# Altium project RC522_RFID.PrjPcb
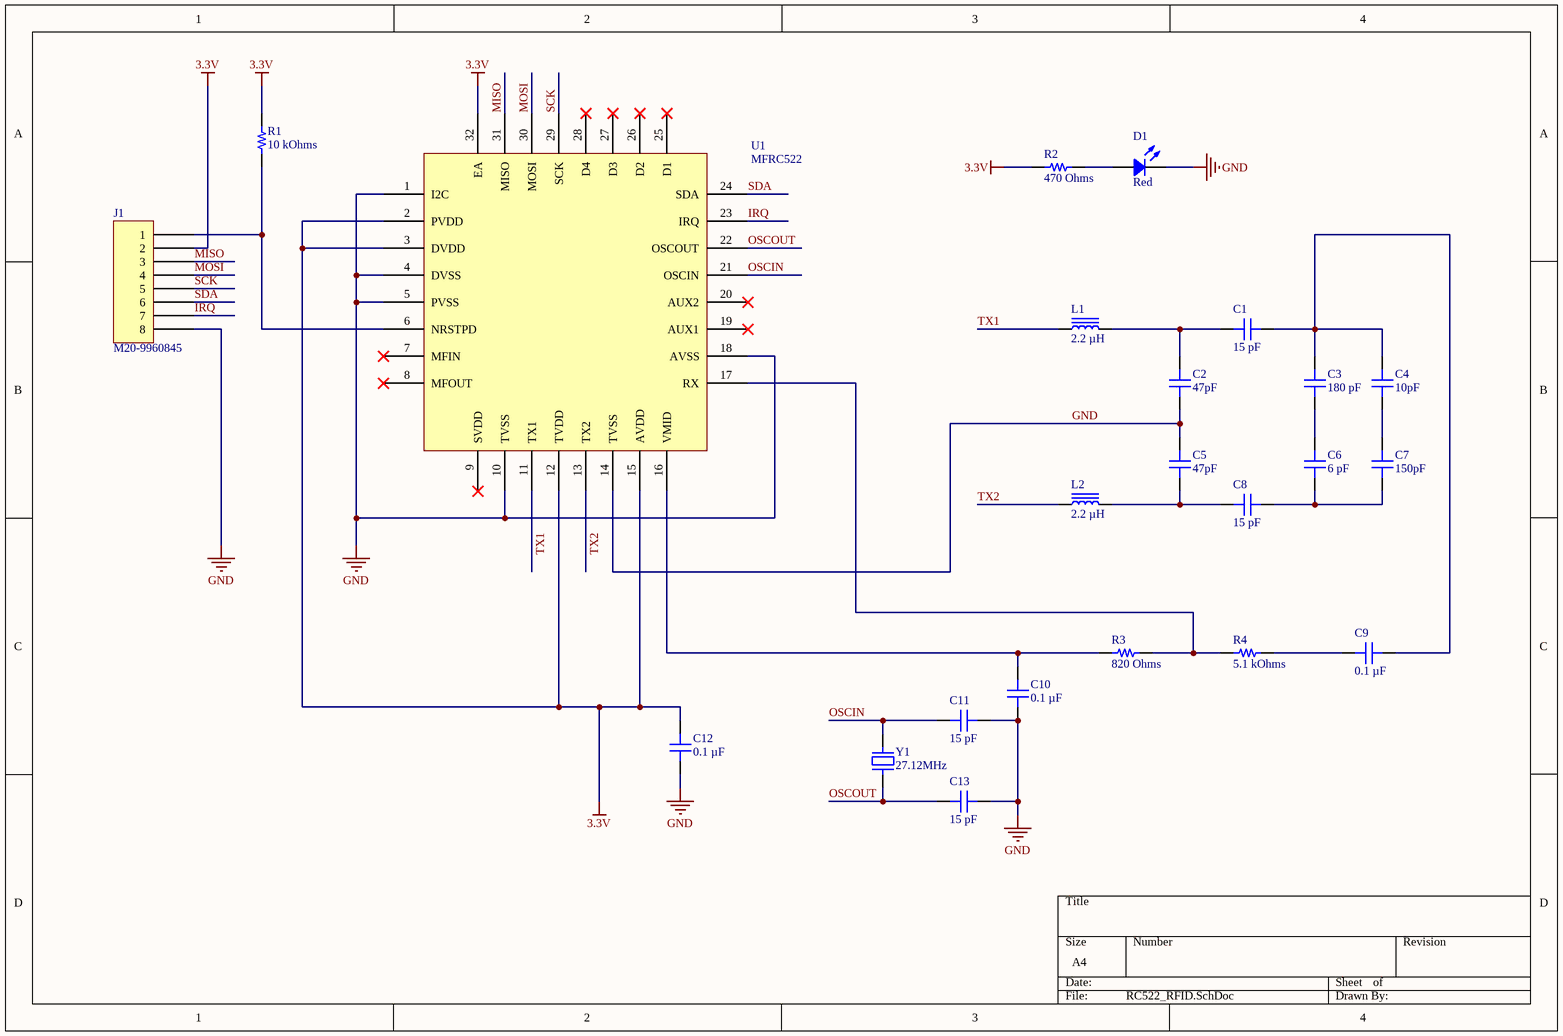
[diagram p0: RC522_RFID.SchDoc]
1 sheet, 23 parts. Net scope: global (net labels, ports and power ports of the same name join across sheets).
Board file: RC522_RFID.PcbDoc

## Sheet RC522_RFID.SchDoc
size A4; SheetNumber: 1; SheetTotal: 1

### Parts
C1  15 pF  [CAP 0805_2012]
C2  47pF  [CAP 0805_2012]
C3  180 pF  [CAP 0805_2012]
C4  10pF  [CAP 0805_2012]
C5  47pF  [CAP 0805_2012]
C6  6 pF  [CAP 0805_2012]
C7  150pF  [CAP 0805_2012]
C8  15 pF  [CAP 0805_2012]
C9  0.1 µF  [CAP 0805_2012]
C10  0.1 µF  [CAP 0805_2012]
C11  15 pF  [CAP 0805_2012]
C12  0.1 µF  [CAP 0805_2012]
C13  15 pF  [CAP 0805_2012]
D1  Red  [LED 0805_2012 RED]
J1  M20-9960845  [HARWIN M20-9960845]
L1  2.2 µH  [IND 0806_2016]
L2  2.2 µH  [IND 0806_2016]
R1  10 kOhms  [RES 0805_2012]
R2  470 Ohms  [YAGEO RES RK73 RS73 SG73 0805_2012]
R3  820 Ohms  [YAGEO RES 0805_2012]
R4  5.1 kOhms  [YAGEO RES RK73 RS73 SG73 0805_2012]
U1  MFRC522  [MFRC522]
Y1  27.12MHz  [TXC 9C]

### Nets
3.3V: C12.2 J1.2 R1.1 R2.1 U1.2(PVDD) U1.3(DVDD) U1.12(TVDD) U1.15(AVDD) U1.32(EA)
GND: C2.1 C5.2 C10.1 C11.1 C12.1 C13.2 D1.2 J1.8 U1.1(I2C) U1.4(DVSS) U1.5(PVSS) U1.10(TVSS) U1.14(TVSS) U1.18(AVSS)
IRQ: J1.7 U1.23(IRQ)
MISO: J1.3 U1.31(MISO)
MOSI: J1.4 U1.30(MOSI)
OSCIN: C11.2 U1.21(OSCIN) Y1.2
OSCOUT: C13.1 U1.22(OSCOUT) Y1.1
SCK: J1.5 U1.29(SCK)
SDA: J1.6 U1.24(SDA)
TX1: L1.1 U1.11(TX1)
TX2: L2.1 U1.13(TX2)
NetC1_1: C1.1 C2.2 L1.2
NetC1_2: C1.2 C3.2 C4.2 C9.2
NetC3_1: C3.1 C6.2
NetC4_1: C4.1 C7.2
NetC5_1: C5.1 C8.1 L2.2
NetC6_1: C6.1 C7.1 C8.2
NetC9_1: C9.1 R4.2
NetC10_2: C10.2 R3.1 U1.16(VMID)
NetD1_1: D1.1 R2.2
NetJ1_1: J1.1 R1.2 U1.6(NRSTPD)
NetR3_2: R3.2 R4.1 U1.17(RX)

Not connected (* = marked no-connect by the designer): U1 7(MFIN)* 8(MFOUT)* 9(SVDD)* 19(AUX1)* 20(AUX2)* 25(D1)* 26(D2)* 27(D3)* 28(D4)*

### Library data of the parts
C1 C8 C11 C13 = 885012007029: CAP CER 15PF 25V C0G/NP0 0805; manufacturer: Würth Elektronik; Temperature Coefficient: C0G, NP0; Tolerance: ±5%; Part Number: 885012007029; Capacitance: 15 pF; Applications: General Purpose; componentlink1description: Datasheet; componentlink1url: https://katalog.we-online.de/pbs/datasheet/885012007029.pdf; componentlink2description: DigiKey Link; componentlink2url: https://www.digikey.com/en/products/detail/würth-elektronik/885012007029/5453683; Device Package: 0805 (2012 Metric); lastupdated: 9.02.2024 20:16:04; Lifecycle Status: Active; Minimum Order: 1; Mounting Type: Surface Mount, MLCC; Operating Temperature: -55°C ~ 125°C; Package / Case: 0805 (2012 Metric); packaging: TapeAndReel; partid: 4245; Part Status: Active; price: 0.03; series: WCAP-CSGP; Size / Dimension: 0.079" L x 0.049" W (2.00mm x 1.25mm); Supplier 1: DigiKey; Supplier Part Number 1: 732-7828-1-ND; Thickness (Max): 0.028" (0.70mm); value: 15 pF; Voltage - Rated: 25V
C2 C5 = 08055A470KAT2A: CAP CER 47PF 50V C0G/NP0 0805; manufacturer: AVX Corporation; Temperature Coefficient: C0G, NP0; Tolerance: ±10%; Part Number: 08055A470KAT2A; Capacitance: 47pF; Applications: General Purpose; componentlink1description: Datasheet; componentlink1url: http://datasheets.avx.com/C0GNP0-Dielectric.pdf; componentlink2description: DigiKey Link; componentlink2url: http://digikey.com/product-detail/en/avx-corporation/08055A470KAT2A/478-7955-1-ND/3881578; Device Package: 0805 (2012 Metric); lastupdated: 2.09.2020 01:04:33; Lifecycle Status: Active; Minimum Order: 1; Mounting Type: Surface Mount, MLCC; Operating Temperature: -55°C ~ 125°C; Package / Case: 0805 (2012 Metric); packaging: TapeAndReel; partid: 7689; Part Status: Active; price: 0.04; series: -; Size / Dimension: 0.079" L x 0.049" W (2.00mm x 1.25mm); Supplier 1: DigiKey; Supplier Part Number 1: 478-7955-1-ND; Thickness (Max): 0.037" (0.94mm); value: 47pF; Voltage - Rated: 50V
C3 = VJ0805Y181KXAPW1BC: CAP CER 180PF 50V X7R 0805; manufacturer: Vishay Vitramon; Tolerance: ±10%; Part Number: VJ0805Y181KXAPW1BC; Capacitance: 180 pF; Applications: General Purpose; componentlink1description: Datasheet; componentlink1url: https://www.vishay.com/docs/28548/vjw1bcbascomseries.pdf; componentlink2description: DigiKey Link; componentlink2url: https://www.digikey.com/en/products/detail/vishay-vitramon/VJ0805Y181KXAPW1BC/8311623; Device Package: 0805 (2012 Metric); lastupdated: 9.02.2024 20:15:03; Lifecycle Status: Active; Minimum Order: 1; Mounting Type: Surface Mount, MLCC; Operating Temperature: -55°C ~ 125°C; Package / Case: 0805 (2012 Metric); packaging: TapeAndReel; partid: 31661; Part Status: Active; price: 0.04; series: VJ W1BC; Size / Dimension: 0.079" L x 0.049" W (2.00mm x 1.25mm); Supplier 1: DigiKey; Supplier Part Number 1: 720-VJ0805Y181KXAPW1BCCT-ND; Temperature Coefficient: X7R; Thickness (Max): 0.035" (0.90mm); value: 180 pF; Voltage - Rated: 50V
C4 = 08055C100KAT2A: CAP CER 10PF 50V X7R 0805; manufacturer: AVX Corporation; Tolerance: ±10%; Part Number: 08055C100KAT2A; Capacitance: 10pF; Applications: General Purpose; componentlink1description: Datasheet; componentlink1url: http://datasheets.avx.com/X7RDielectric.pdf; componentlink2description: DigiKey Link; componentlink2url: http://digikey.com/product-detail/en/avx-corporation/08055C100KAT2A/478-11897-1-ND/8573533; Device Package: 0805 (2012 Metric); lastupdated: 2.09.2020 01:04:33; Lifecycle Status: Active; Minimum Order: 1; Mounting Type: Surface Mount, MLCC; Operating Temperature: -55°C ~ 125°C; Package / Case: 0805 (2012 Metric); packaging: TapeAndReel; partid: 7680; Part Status: Active; price: 0.04; series: -; Size / Dimension: 0.079" L x 0.049" W (2.01mm x 1.25mm); Supplier 1: DigiKey; Supplier Part Number 1: 478-11897-1-ND; Temperature Coefficient: X7R; Thickness (Max): 0.037" (0.94mm); value: 10pF; Voltage - Rated: 50V
C6 = CC0805DRNPO9BN6R0: CAP CER 6PF 50V C0G/NPO 0805; manufacturer: Yageo; Temperature Coefficient: C0G, NP0; Tolerance: ±0.5pF; Part Number: CC0805DRNPO9BN6R0; Capacitance: 6 pF; Applications: General Purpose; componentlink1description: Datasheet; componentlink1url: https://www.yageo.com/upload/media/product/productsearch/datasheet/mlcc/UPY-GP_NP0_16V-to-50V_17.pdf; componentlink2description: DigiKey Link; componentlink2url: https://www.digikey.com/en/products/detail/yageo/CC0805DRNPO9BN6R0/302829; Device Package: 0805 (2012 Metric); lastupdated: 9.02.2024 20:15:53; Lifecycle Status: Active; Minimum Order: 1; Mounting Type: Surface Mount, MLCC; Operating Temperature: -55°C ~ 125°C; Package / Case: 0805 (2012 Metric); packaging: TapeAndReel; partid: 44312; Part Status: Active; price: 0.01; series: CC; Size / Dimension: 0.079" L x 0.049" W (2.00mm x 1.25mm); Supplier 1: DigiKey; Supplier Part Number 1: 311-1095-1-ND; Thickness (Max): 0.024" (0.60mm); value: 6 pF; Voltage - Rated: 50V
C7 = 08055C151KAT2A: CAP CER 150PF 50V X7R 0805; manufacturer: AVX Corporation; Tolerance: ±10%; Part Number: 08055C151KAT2A; Capacitance: 150pF; Applications: General Purpose; componentlink1description: Datasheet; componentlink1url: http://datasheets.avx.com/X7RDielectric.pdf; componentlink2description: DigiKey Link; componentlink2url: http://digikey.com/product-detail/en/avx-corporation/08055C151KAT2A/478-10547-1-ND/6797477; Device Package: 0805 (2012 Metric); lastupdated: 2.09.2020 01:04:40; Lifecycle Status: Active; Minimum Order: 1; Mounting Type: Surface Mount, MLCC; Operating Temperature: -55°C ~ 125°C; Package / Case: 0805 (2012 Metric); packaging: TapeAndReel; partid: 3187; Part Status: Active; price: 0.02; series: -; Size / Dimension: 0.079" L x 0.049" W (2.01mm x 1.25mm); Supplier 1: DigiKey; Supplier Part Number 1: 478-10547-1-ND; Temperature Coefficient: X7R; Thickness (Max): 0.037" (0.94mm); value: 150pF; Voltage - Rated: 50V
C9 C10 C12 = VJ0805Y104KXXCW1BC: CAP CER 0.1UF 25V X7R 0805; manufacturer: Vishay Vitramon; Tolerance: ±10%; Part Number: VJ0805Y104KXXCW1BC; Capacitance: 0.1 µF; Applications: General Purpose; componentlink1description: Datasheet; componentlink1url: https://www.vishay.com/docs/28548/vjw1bcbascomseries.pdf; componentlink2description: DigiKey Link; componentlink2url: https://www.digikey.com/en/products/detail/vishay-vitramon/VJ0805Y104KXXCW1BC/420914; Device Package: 0805 (2012 Metric); lastupdated: 9.02.2024 20:15:21; Lifecycle Status: Active; Minimum Order: 1; Mounting Type: Surface Mount, MLCC; Operating Temperature: -55°C ~ 125°C; Package / Case: 0805 (2012 Metric); packaging: TapeAndReel; partid: 17950; Part Status: Active; price: 0.04; series: VJ W1BC; Size / Dimension: 0.079" L x 0.049" W (2.00mm x 1.25mm); Supplier 1: DigiKey; Supplier Part Number 1: 720-1537-1-ND; Temperature Coefficient: X7R; Thickness (Max): 0.037" (0.95mm); value: 0.1 µF; Voltage - Rated: 25V
D1 = 5988120107F: LED RED CLEAR 0805 SMD; Manufacturer: Dialight; Configuration: Standard; Current - Test: 20mA; Lens Color: Colorless; Lens Size: 1.40mm x 1.25mm; Lens Style: Rectangle with Flat Top; Millicandela Rating: 150mcd; Viewing Angle: 140°; Voltage - Forward (Vf) (Typ): 2V; Wavelength - Dominant: 625nm; Part Number: 5988120107F; Color: Red; ComponentLink1Description: Datasheet; ComponentLink1URL: //media.digikey.com/pdf/Data%20Sheets/Dialight%20PDFs/598_Series_0805_Pkg.pdf; ComponentLink2Description: DigiKey Link; ComponentLink2URL: https://www.digikey.com/en/products/detail/dialight/5988120107F/1291273; Device Package: 0805 (2012 Metric); Height (Max): 0.80mm; LastUpdated: 3.06.2024 20:00:07; Lens Transparency: Clear; Lifecycle Status: Active; Minimum Order: 1; Mounting Type: Surface Mount; Package / Case: 0805 (2012 Metric); Packaging: TapeAndReel; PartId: 309; Part Status: Active; Price: 0.05; Series: 598; Size / Dimension: 2.00mm L x 1.25mm W; Supplier 1: DigiKey; Supplier Part Number 1: 350-2039-1-ND; Supplier Device Package: 0805; Value: Red
J1 = M20-9960845: CONN HEADER R/A 8POS 2.54MM; Manufacturer: Harwin Inc.; Connector Type: Header, Cuttable; Contact Length - Mating: 0.240" (6.10mm); Contact Length - Post: 0.118" (3.00mm); Current Rating (Amps): 3A per Contact; Material Flammability Rating: UL94 V-0; Number of Positions: 8; Number of Positions Loaded: All; Pitch - Mating: 0.100" (2.54mm); Row Spacing - Mating: -40°C ~ 105°C; Shrouding: Unshrouded; Style: Board to Board or Cable; Part Number: M20-9960845; ComponentLink1Description: Datasheet; ComponentLink1URL: https://cdn.harwin.com/pdfs/Harwin_PC_Connectors_M20.pdf; ComponentLink2Description: DigiKey Link; ComponentLink2URL: https://www.digikey.com/en/products/detail/harwin-inc/M20-9960845/3728213; Contact Finish - Mating: Gold; Contact Material: Brass; Contact Shape: Square; Contact Type: Male Pin; Fastening Type: Push-Pull; Insulation Color: Black; Insulation Height: 0.100" (2.54mm); Insulation Material: Polyamide (PA6T), Nylon 6T; LastUpdated: 21.09.2022 19:24:16; Lifecycle Status: Active; Minimum Order: 1; Mounting Type: Through Hole, Right Angle; Number of Rows: 1; Operating Temperature: -40°C ~ 105°C; Packaging: Bulk; PartId: 171; Part Status: Active; Price: 0.20; Series: M20; Supplier 1: DigiKey; Supplier Part Number 1: 952-2249-ND; Termination: Solder
L1 L2 = WPN201610U2R2MTY01: FIXED IND 2.2UH 2A 138 MOHM SMD; Manufacturer: Shenzhen Sunlord Electronics Co., Ltd.; DC Resistance (DCR): 138mOhm Max; Frequency - Self Resonant: 44MHz; Inductance Frequency - Test: 1 MHz; Material - Core: Ferrite; Shielding: Shielded; Tolerance: ±20%; Type: Drum Core, Wirewound; Part Number: WPN201610U2R2MTY01; ComponentLink1Description: Datasheet; ComponentLink1URL: https://www.sunlordinc.com/Download.aspx?file=L1VwbG9hZEZpbGVzL1BERl9DYXQvMjAyMDA3MDcxNTI5MjQ4NTUucGRm&lan=; ComponentLink2Description: DigiKey Link; ComponentLink2URL: https://www.digikey.com/en/products/detail/shenzhen-sunlord-electronics-co-ltd/WPN201610U2R2MTY01/14120427; Current Rating (Amps): 2 A; Device Package: 0806 (2016 Metric); Height - Seated (Max): 0.039" (1.00mm); Inductance: 2.2 µH; LastUpdated: 3.06.2024 20:14:08; Lifecycle Status: Active; Minimum Order: 1; Mounting Type: Surface Mount; Operating Temperature: -40°C ~ 125°C; Package / Case: 0806 (2016 Metric); Packaging: TapeAndReel; PartId: 5370; Part Status: Active; Price: 0.15; Series: WPN; Size / Dimension: 0.079" L x 0.063" W (2.00mm x 1.60mm); Supplier 1: DigiKey; Supplier Part Number 1: 3442-WPN201610U2R2MTY01CT-ND; Supplier Device Package: 0806; Value: 2.2 µH
R1 = SDR10EZPF1002: RES 10K OHM 1% 1/2W 0805; Manufacturer: Rohm Semiconductor; Power (Watts): 0.5W, 1/2W; Temperature Coefficient: ±100ppm/°C; Part Number: SDR10EZPF1002; Value: 10 kOhms; ComponentLink2Description: DigiKey Link; ComponentLink2URL: https://www.digikey.com/en/products/detail/rohm-semiconductor/SDR10EZPF1002/18674792; Composition: Thick Film; Device Package: 0805 (2012 Metric); Features: Automotive AEC-Q200, Pulse Withstanding; Height - Seated (Max): 0.026" (0.65mm); LastUpdated: 8.02.2024 21:00:06; Lifecycle Status: Active; Minimum Order: 1; Number of Terminations: 2; Operating Temperature: -55°C ~ 155°C; Package / Case: 0805 (2012 Metric); Packaging: TapeAndReel; PartId: 76828; Part Status: Active; Price: 0.03; Ratings: AEC-Q200; Resistance: 10 kOhms; Series: SDR; Size / Dimension: 0.079" L x 0.049" W (2.00mm x 1.25mm); Supplier 1: DigiKey; Supplier Part Number 1: 511-SDR10EZPF1002CT-ND; Supplier Device Package: 0805; Tolerance: ±1%
R2 = SG73P2ATTD4700F: RES 470 OHM 1% 1/2W 0805; Manufacturer: KOA Speer Electronics, Inc.; Power (Watts): 0.5W, 1/2W; Temperature Coefficient: ±100ppm/°C; Part Number: SG73P2ATTD4700F; Value: 470 Ohms; ComponentLink1Description: Datasheet; ComponentLink1URL: https://www.koaspeer.com/pdfs/SG73P.pdf; ComponentLink2Description: DigiKey Link; ComponentLink2URL: https://www.digikey.com/en/products/detail/koa-speer-electronics-inc/SG73P2ATTD4700F/10188391; Composition: Thick Film; Device Package: 0805 (2012 Metric); Features: Automotive AEC-Q200, Pulse Withstanding; Height - Seated (Max): 0.024" (0.60mm); LastUpdated: 25.07.2024 09:45:15; Lifecycle Status: Active; Minimum Order: 1; Number of Terminations: 2; Operating Temperature: -55°C ~ 155°C; Package / Case: 0805 (2012 Metric); Packaging: TapeAndReel; PartId: 61085; Part Status: Active; Price: 0.02; Ratings: AEC-Q200; Resistance: 470 Ohms; Series: SG73P; Size / Dimension: 0.079" L x 0.049" W (2.00mm x 1.25mm); Supplier 1: DigiKey; Supplier Part Number 1: 2019-SG73P2ATTD4700FCT-ND; Supplier Device Package: 0805; Tolerance: ±1%
R3 = SR0805FR-47820RL: RES 820 OHM 1% 1/2W 0805; Manufacturer: Yageo; Power (Watts): 0.5W, 1/2W; Temperature Coefficient: ±100ppm/°C; Part Number: SR0805FR-47820RL; Value: 820 Ohms; ComponentLink1Description: Datasheet; ComponentLink1URL: http://www.yageo.com/NewPortal/_en/search/productDocs.jsp?YageoPartNumber=SR0805FR-47820RL; ComponentLink2Description: DigiKey Link; ComponentLink2URL: https://www.digikey.com/en/products/detail/yageo/SR0805FR-47820RL/9696414; Composition: Thick Film; Device Package: 0805 (2012 Metric); Features: Automotive AEC-Q200, Pulse Withstanding; Height - Seated (Max): 0.024" (0.60mm); LastUpdated: 25.07.2024 09:20:20; Lifecycle Status: Active; Minimum Order: 1; Number of Terminations: 2; Operating Temperature: -55°C ~ 155°C; Package / Case: 0805 (2012 Metric); Packaging: TapeAndReel; PartId: 40903; Part Status: Active; Price: 0.14; Ratings: AEC-Q200; Resistance: 820 Ohms; Series: SR; Size / Dimension: 0.079" L x 0.049" W (2.00mm x 1.25mm); Supplier 1: DigiKey; Supplier Part Number 1: YAG6176CT-ND; Supplier Device Package: 0805; Tolerance: ±1%
R4 = SG73P2ATTD5101F: RES 5.1K OHM 1% 1/2W 0805; Manufacturer: KOA Speer Electronics, Inc.; Power (Watts): 0.5W, 1/2W; Temperature Coefficient: ±100ppm/°C; Part Number: SG73P2ATTD5101F; Value: 5.1 kOhms; ComponentLink1Description: Datasheet; ComponentLink1URL: https://www.koaspeer.com/pdfs/SG73P.pdf; ComponentLink2Description: DigiKey Link; ComponentLink2URL: https://www.digikey.com/en/products/detail/koa-speer-electronics-inc/SG73P2ATTD5101F/10188303; Composition: Thick Film; Device Package: 0805 (2012 Metric); Features: Automotive AEC-Q200, Pulse Withstanding; Height - Seated (Max): 0.024" (0.60mm); LastUpdated: 25.07.2024 09:45:07; Lifecycle Status: Active; Minimum Order: 1; Number of Terminations: 2; Operating Temperature: -55°C ~ 155°C; Package / Case: 0805 (2012 Metric); Packaging: TapeAndReel; PartId: 90019; Price: 0.02; Ratings: AEC-Q200; Resistance: 5.1 kOhms; Series: SG73P; Size / Dimension: 0.079" L x 0.049" W (2.00mm x 1.25mm); Supplier 1: DigiKey; Supplier Part Number 1: 2019-SG73P2ATTD5101FCT-ND; Supplier Device Package: 0805; Tolerance: ±1%
Y1 = 9C-27.120MAAJ-T: CRYSTAL 27.1200MHZ 18PF SMD; Manufacturer: TXC CORPORATION; ESR (Equivalent Series Resistance): 30 Ohms; Frequency Stability: ±30ppm; Operating Mode: Fundamental; Part Number: 9C-27.120MAAJ-T; ComponentLink1Description: Datasheet; ComponentLink1URL: http://www.txccorp.com/download/products/quartz_crystals/2015TXC_9C_32.pdf; ComponentLink2Description: DigiKey Link; ComponentLink2URL: http://digikey.com/product-detail/en/txc-corporation/9C-27.120MAAJ-T/887-2446-1-ND/4475495; Frequency: 27.12MHz; Frequency Tolerance: ±30ppm; Height - Seated (Max): 0.161" (4.10mm); LastUpdated: 3.06.2024 20:02:24; Lifecycle Status: Active; Load Capacitance: 18pF; Minimum Order: 1; Mounting Type: Surface Mount; Operating Temperature: -20°C ~ 70°C; Package / Case: HC-49S; Packaging: TapeAndReel; PartId: 700; Part Status: Active; Price: 0.19; Series: 9C; Size / Dimension: 0.449" L x 0.189" W (11.40mm x 4.80mm); Supplier 1: DigiKey; Supplier Part Number 1: 887-2446-1-ND; Type: MHz Crystal; Value: 27.12MHz